# EasyEDA schematic SCH_Protoboard-2x5x17-2.54-FR4_2026-02-27.json
TITLE: Mini Protoboard 2x5x17h; REV: 0.1; Date: 2026-02-27; Sheet: 1/1; Drawn By: joshuauu; Company: uurnd.com
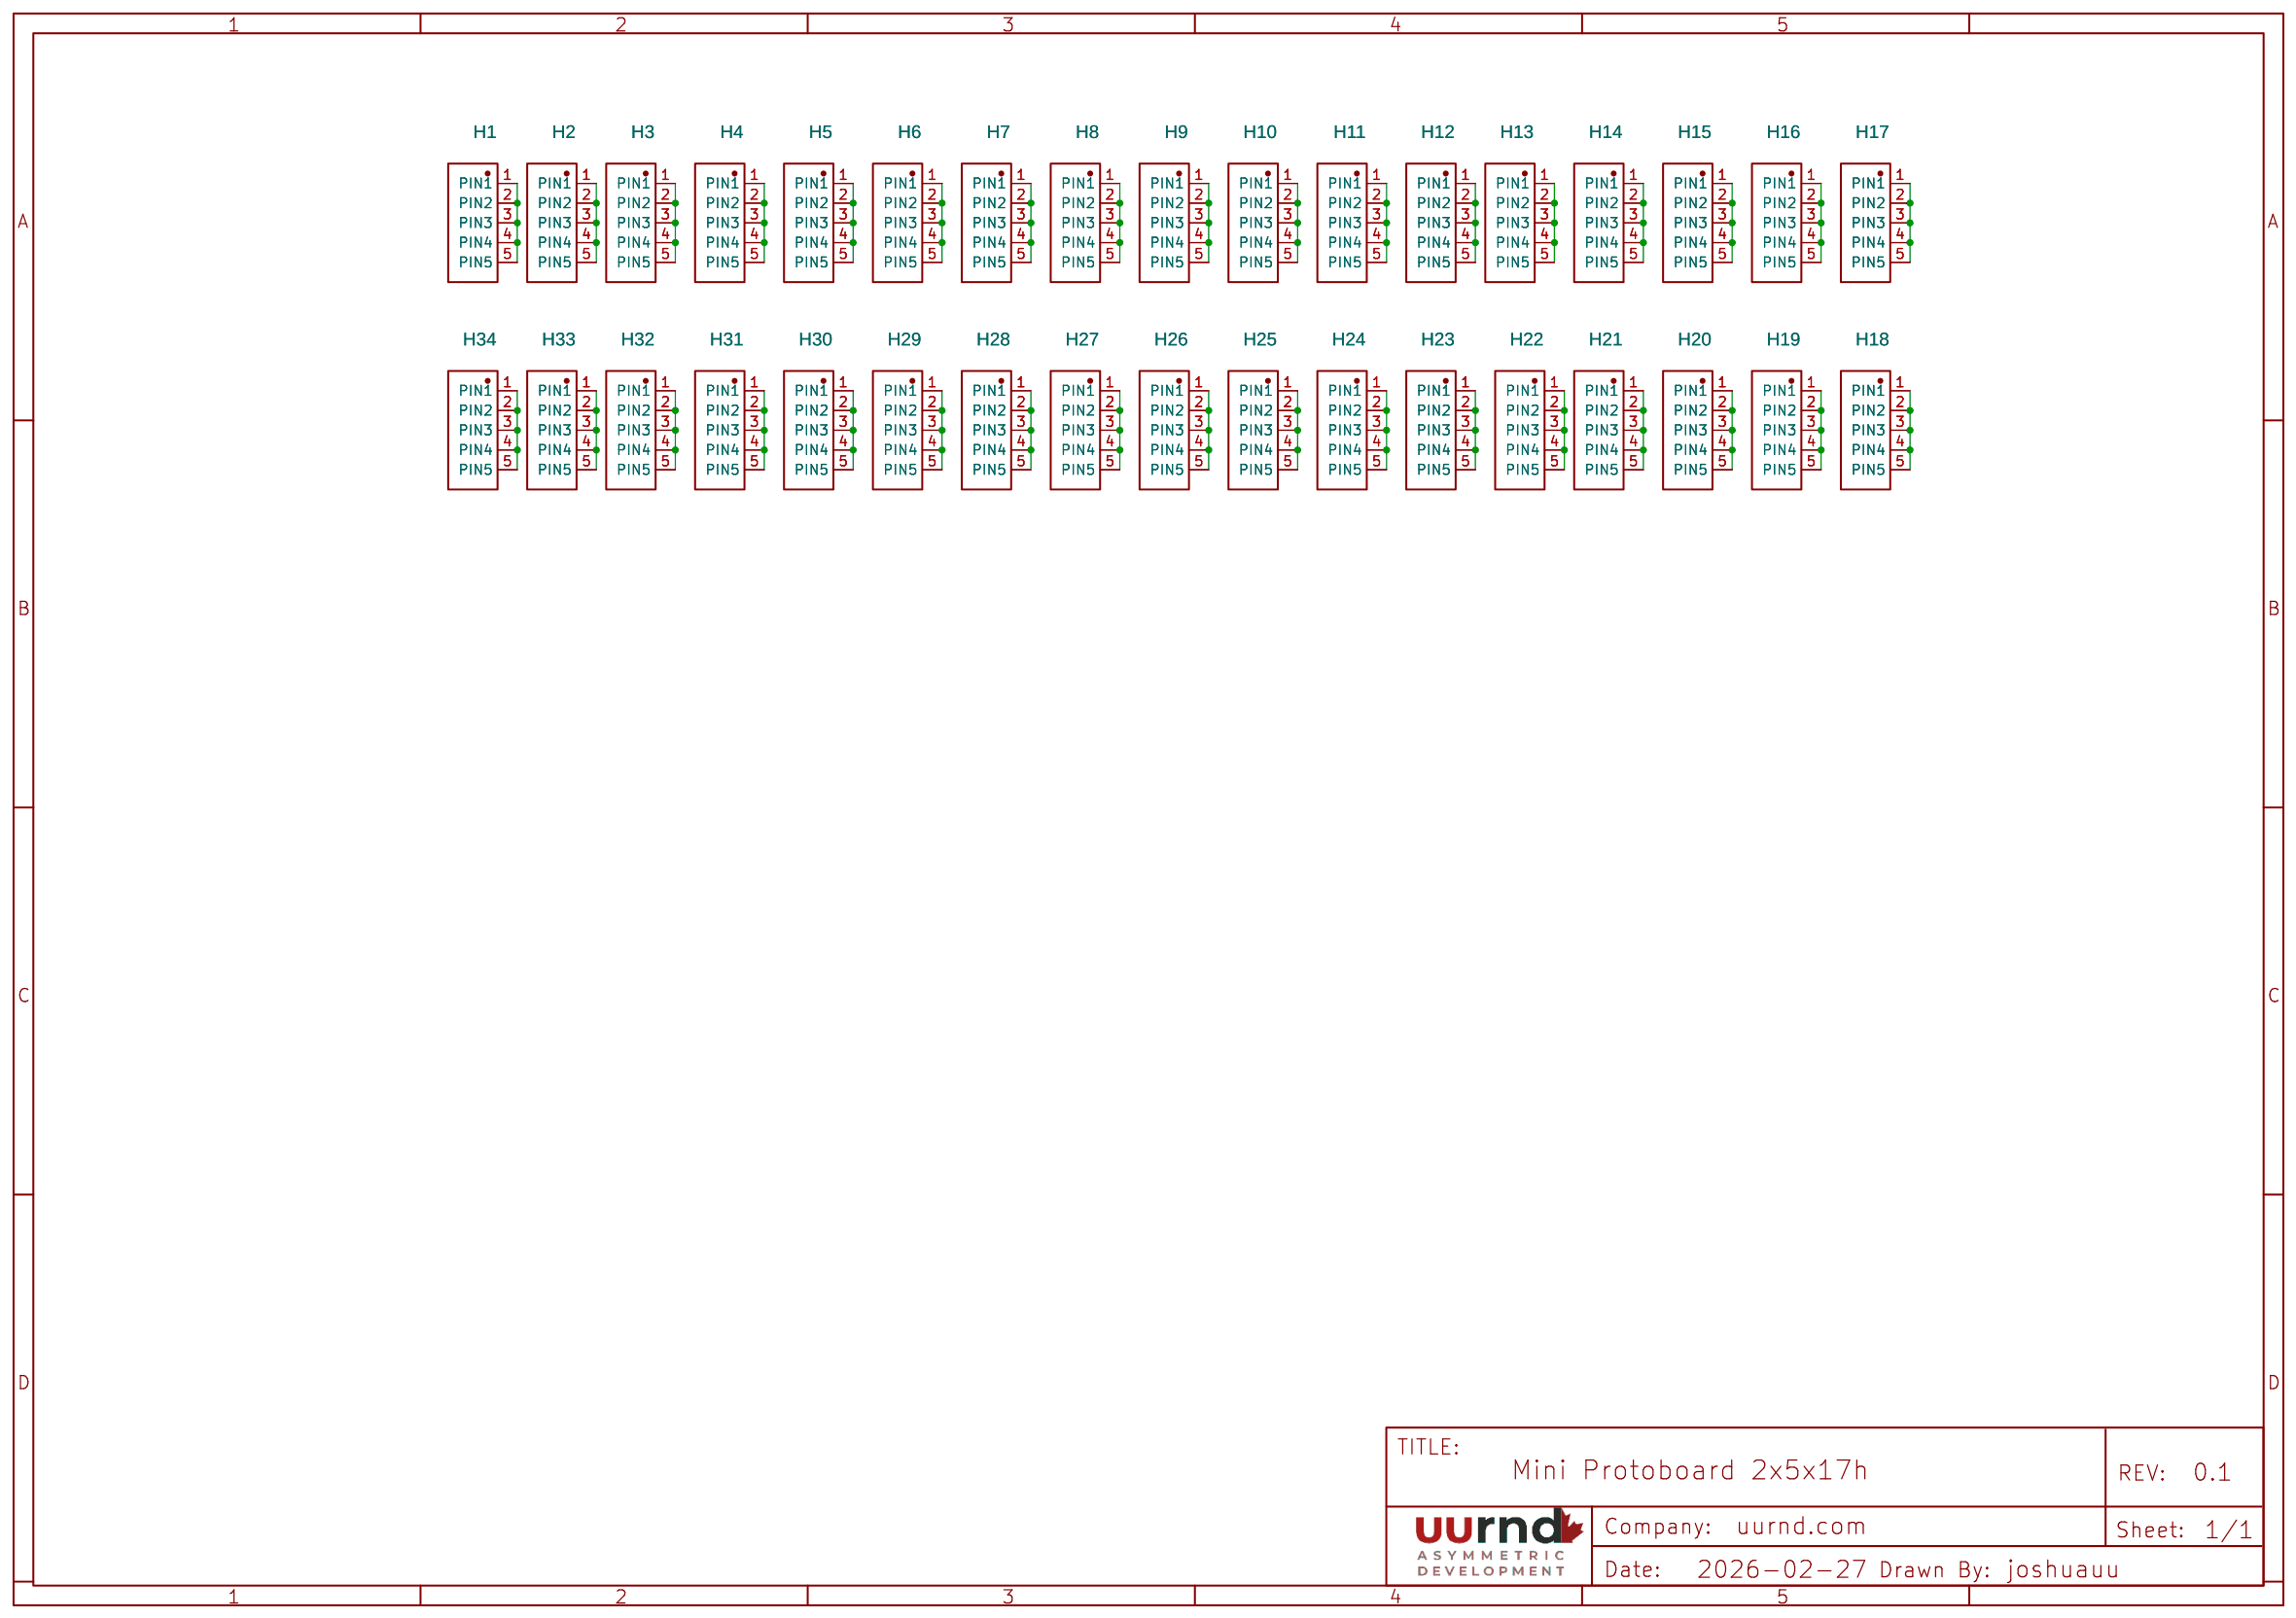
[diagram p0: schematic sheet]

## Parts
H1  UU TOP SINGLE SIDE HEADER_2.54MM_1X5P  [UU //DIP-1X5P-2.54MM-UU RINGLINKUP]
H2  UU TOP SINGLE SIDE HEADER_2.54MM_1X5P  [UU //DIP-1X5P-2.54MM-UU RINGLINKUP]
H3  UU TOP SINGLE SIDE HEADER_2.54MM_1X5P  [UU //DIP-1X5P-2.54MM-UU RINGLINKUP]
H4  UU TOP SINGLE SIDE HEADER_2.54MM_1X5P  [UU //DIP-1X5P-2.54MM-UU RINGLINKUP]
H5  UU TOP SINGLE SIDE HEADER_2.54MM_1X5P  [UU //DIP-1X5P-2.54MM-UU RINGLINKUP]
H6  UU TOP SINGLE SIDE HEADER_2.54MM_1X5P  [UU //DIP-1X5P-2.54MM-UU RINGLINKUP]
H7  UU TOP SINGLE SIDE HEADER_2.54MM_1X5P  [UU //DIP-1X5P-2.54MM-UU RINGLINKUP]
H8  UU TOP SINGLE SIDE HEADER_2.54MM_1X5P  [UU //DIP-1X5P-2.54MM-UU RINGLINKUP]
H9  UU TOP SINGLE SIDE HEADER_2.54MM_1X5P  [UU //DIP-1X5P-2.54MM-UU RINGLINKUP]
H10  UU TOP SINGLE SIDE HEADER_2.54MM_1X5P  [UU //DIP-1X5P-2.54MM-UU RINGLINKUP]
H11  UU TOP SINGLE SIDE HEADER_2.54MM_1X5P  [UU //DIP-1X5P-2.54MM-UU RINGLINKUP]
H12  UU TOP SINGLE SIDE HEADER_2.54MM_1X5P  [UU //DIP-1X5P-2.54MM-UU RINGLINKUP]
H13  UU TOP SINGLE SIDE HEADER_2.54MM_1X5P  [UU //DIP-1X5P-2.54MM-UU RINGLINKUP]
H14  UU TOP SINGLE SIDE HEADER_2.54MM_1X5P  [UU //DIP-1X5P-2.54MM-UU RINGLINKUP]
H15  UU TOP SINGLE SIDE HEADER_2.54MM_1X5P  [UU //DIP-1X5P-2.54MM-UU RINGLINKUP]
H16  UU TOP SINGLE SIDE HEADER_2.54MM_1X5P  [UU //DIP-1X5P-2.54MM-UU RINGLINKUP]
H17  UU TOP SINGLE SIDE HEADER_2.54MM_1X5P  [UU //DIP-1X5P-2.54MM-UU RINGLINKUP]
H18  UU TOP SINGLE SIDE HEADER_2.54MM_1X5P  [UU //DIP-1X5P-2.54MM-UU RINGLINKUP]
H19  UU TOP SINGLE SIDE HEADER_2.54MM_1X5P  [UU //DIP-1X5P-2.54MM-UU RINGLINKUP]
H20  UU TOP SINGLE SIDE HEADER_2.54MM_1X5P  [UU //DIP-1X5P-2.54MM-UU RINGLINKUP]
H21  UU TOP SINGLE SIDE HEADER_2.54MM_1X5P  [UU //DIP-1X5P-2.54MM-UU RINGLINKUP]
H22  UU TOP SINGLE SIDE HEADER_2.54MM_1X5P  [UU //DIP-1X5P-2.54MM-UU RINGLINKUP]
H23  UU TOP SINGLE SIDE HEADER_2.54MM_1X5P  [UU //DIP-1X5P-2.54MM-UU RINGLINKUP]
H24  UU TOP SINGLE SIDE HEADER_2.54MM_1X5P  [UU //DIP-1X5P-2.54MM-UU RINGLINKUP]
H25  UU TOP SINGLE SIDE HEADER_2.54MM_1X5P  [UU //DIP-1X5P-2.54MM-UU RINGLINKUP]
H26  UU TOP SINGLE SIDE HEADER_2.54MM_1X5P  [UU //DIP-1X5P-2.54MM-UU RINGLINKUP]
H27  UU TOP SINGLE SIDE HEADER_2.54MM_1X5P  [UU //DIP-1X5P-2.54MM-UU RINGLINKUP]
H28  UU TOP SINGLE SIDE HEADER_2.54MM_1X5P  [UU //DIP-1X5P-2.54MM-UU RINGLINKUP]
H29  UU TOP SINGLE SIDE HEADER_2.54MM_1X5P  [UU //DIP-1X5P-2.54MM-UU RINGLINKUP]
H30  UU TOP SINGLE SIDE HEADER_2.54MM_1X5P  [UU //DIP-1X5P-2.54MM-UU RINGLINKUP]
H31  UU TOP SINGLE SIDE HEADER_2.54MM_1X5P  [UU //DIP-1X5P-2.54MM-UU RINGLINKUP]
H32  UU TOP SINGLE SIDE HEADER_2.54MM_1X5P  [UU //DIP-1X5P-2.54MM-UU RINGLINKUP]
H33  UU TOP SINGLE SIDE HEADER_2.54MM_1X5P  [UU //DIP-1X5P-2.54MM-UU RINGLINKUP]
H34  UU TOP SINGLE SIDE HEADER_2.54MM_1X5P  [UU //DIP-1X5P-2.54MM-UU RINGLINKUP]

## Library data of the parts
H1-H34 = UU TOP SINGLE SIDE HEADER_2.54MM_1X5P: Manufacturer: uuinc; Supplier: uuinc; Contributor: joshuauu; Package Display: No

## Nets
Net-(H1-1): H1.1(PIN1) H1.2(PIN2) H1.3(PIN3) H1.4(PIN4) H1.5(PIN5)
Net-(H2-1): H2.1(PIN1) H2.2(PIN2) H2.3(PIN3) H2.4(PIN4) H2.5(PIN5)
Net-(H3-1): H3.1(PIN1) H3.2(PIN2) H3.3(PIN3) H3.4(PIN4) H3.5(PIN5)
Net-(H4-1): H4.1(PIN1) H4.2(PIN2) H4.3(PIN3) H4.4(PIN4) H4.5(PIN5)
Net-(H5-1): H5.1(PIN1) H5.2(PIN2) H5.3(PIN3) H5.4(PIN4) H5.5(PIN5)
Net-(H6-1): H6.1(PIN1) H6.2(PIN2) H6.3(PIN3) H6.4(PIN4) H6.5(PIN5)
Net-(H7-1): H7.1(PIN1) H7.2(PIN2) H7.3(PIN3) H7.4(PIN4) H7.5(PIN5)
Net-(H8-1): H8.1(PIN1) H8.2(PIN2) H8.3(PIN3) H8.4(PIN4) H8.5(PIN5)
Net-(H9-1): H9.1(PIN1) H9.2(PIN2) H9.3(PIN3) H9.4(PIN4) H9.5(PIN5)
Net-(H10-1): H10.1(PIN1) H10.2(PIN2) H10.3(PIN3) H10.4(PIN4) H10.5(PIN5)
Net-(H11-1): H11.1(PIN1) H11.2(PIN2) H11.3(PIN3) H11.4(PIN4) H11.5(PIN5)
Net-(H12-1): H12.1(PIN1) H12.2(PIN2) H12.3(PIN3) H12.4(PIN4) H12.5(PIN5)
Net-(H13-1): H13.1(PIN1) H13.2(PIN2) H13.3(PIN3) H13.4(PIN4) H13.5(PIN5)
Net-(H14-1): H14.1(PIN1) H14.2(PIN2) H14.3(PIN3) H14.4(PIN4) H14.5(PIN5)
Net-(H15-1): H15.1(PIN1) H15.2(PIN2) H15.3(PIN3) H15.4(PIN4) H15.5(PIN5)
Net-(H16-1): H16.1(PIN1) H16.2(PIN2) H16.3(PIN3) H16.4(PIN4) H16.5(PIN5)
Net-(H17-1): H17.1(PIN1) H17.2(PIN2) H17.3(PIN3) H17.4(PIN4) H17.5(PIN5)
Net-(H18-1): H18.1(PIN1) H18.2(PIN2) H18.3(PIN3) H18.4(PIN4) H18.5(PIN5)
Net-(H19-1): H19.1(PIN1) H19.2(PIN2) H19.3(PIN3) H19.4(PIN4) H19.5(PIN5)
Net-(H20-1): H20.1(PIN1) H20.2(PIN2) H20.3(PIN3) H20.4(PIN4) H20.5(PIN5)
Net-(H21-1): H21.1(PIN1) H21.2(PIN2) H21.3(PIN3) H21.4(PIN4) H21.5(PIN5)
Net-(H22-1): H22.1(PIN1) H22.2(PIN2) H22.3(PIN3) H22.4(PIN4) H22.5(PIN5)
Net-(H23-1): H23.1(PIN1) H23.2(PIN2) H23.3(PIN3) H23.4(PIN4) H23.5(PIN5)
Net-(H24-1): H24.1(PIN1) H24.2(PIN2) H24.3(PIN3) H24.4(PIN4) H24.5(PIN5)
Net-(H25-1): H25.1(PIN1) H25.2(PIN2) H25.3(PIN3) H25.4(PIN4) H25.5(PIN5)
Net-(H26-1): H26.1(PIN1) H26.2(PIN2) H26.3(PIN3) H26.4(PIN4) H26.5(PIN5)
Net-(H27-1): H27.1(PIN1) H27.2(PIN2) H27.3(PIN3) H27.4(PIN4) H27.5(PIN5)
Net-(H28-1): H28.1(PIN1) H28.2(PIN2) H28.3(PIN3) H28.4(PIN4) H28.5(PIN5)
Net-(H29-1): H29.1(PIN1) H29.2(PIN2) H29.3(PIN3) H29.4(PIN4) H29.5(PIN5)
Net-(H30-1): H30.1(PIN1) H30.2(PIN2) H30.3(PIN3) H30.4(PIN4) H30.5(PIN5)
Net-(H31-1): H31.1(PIN1) H31.2(PIN2) H31.3(PIN3) H31.4(PIN4) H31.5(PIN5)
Net-(H32-1): H32.1(PIN1) H32.2(PIN2) H32.3(PIN3) H32.4(PIN4) H32.5(PIN5)
Net-(H33-1): H33.1(PIN1) H33.2(PIN2) H33.3(PIN3) H33.4(PIN4) H33.5(PIN5)
Net-(H34-1): H34.1(PIN1) H34.2(PIN2) H34.3(PIN3) H34.4(PIN4) H34.5(PIN5)
